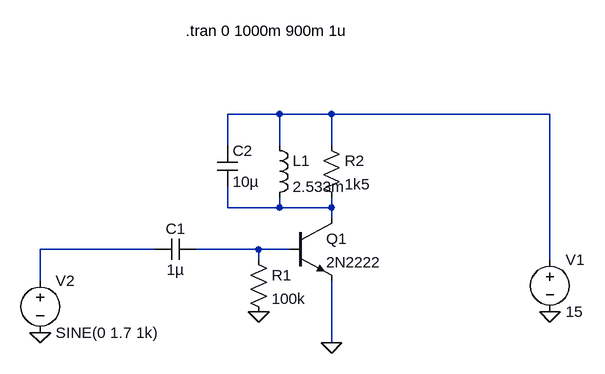
[diagram p0: schematic claseC2.asc]
claseC2.asc, the LTspice schematic file:
Version 4
SHEET 1 880 680
WIRE 144 -16 64 -16
WIRE 224 -16 144 -16
WIRE 560 -16 224 -16
WIRE 64 32 64 -16
WIRE 144 32 144 -16
WIRE 224 32 224 -16
WIRE 64 128 64 96
WIRE 144 128 144 112
WIRE 144 128 64 128
WIRE 224 128 224 112
WIRE 224 128 144 128
WIRE 224 144 224 128
WIRE -48 192 -224 192
WIRE 112 192 16 192
WIRE 160 192 112 192
WIRE 112 208 112 192
WIRE 560 208 560 -16
WIRE -224 240 -224 192
WIRE 224 336 224 240
FLAG 560 288 0
FLAG 224 336 0
FLAG -224 320 0
FLAG 112 288 0
SYMBOL npn 160 144 R0
SYMATTR InstName Q1
SYMATTR Value 2N2222
SYMBOL voltage 560 192 R0
WINDOW 123 0 0 Left 0
WINDOW 39 0 0 Left 0
SYMATTR InstName V1
SYMATTR Value 15
SYMBOL voltage -224 224 R0
WINDOW 123 0 0 Left 0
WINDOW 39 0 0 Left 0
SYMATTR InstName V2
SYMATTR Value SINE(0 1.7 1k)
SYMBOL res 208 16 R0
SYMATTR InstName R2
SYMATTR Value 1k5
SYMBOL res 96 192 R0
SYMATTR InstName R1
SYMATTR Value 100k
SYMBOL cap 16 176 R90
WINDOW 0 0 32 VBottom 2
WINDOW 3 32 32 VTop 2
SYMATTR InstName C1
SYMATTR Value 1µ
SYMBOL ind 128 16 R0
SYMATTR InstName L1
SYMATTR Value 2.533m
SYMBOL cap 48 32 R0
SYMATTR InstName C2
SYMATTR Value 10µ
TEXT 0 -144 Left 2 !.tran 0 1000m 900m 1u

The netlist it stands for:
* claseC2.asc
Q1 N002 N004 0 0 2N2222
V1 N001 0 15
V2 N003 0 SINE(0 1.7 1k)
R2 N001 N002 1k5
R1 N004 0 100k
C1 N004 N003 1µ
L1 N001 N002 2.533m
C2 N001 N002 10µ
.model NPN NPN
.model PNP PNP
.lib standard.bjt
.tran 0 1000m 900m 1u
.backanno
.end